# EAGLE schematic bjt_Vbe_on (EAGLE 7.5.0)
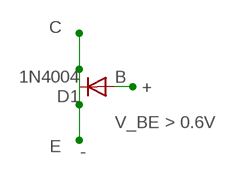
[diagram p0: schematic, sheet 1]

## Parts
D1  1N4004  [DO41-10]

## Nets
N$1: D1.C
N$2: D1.A

## Notes on the sheet
- C
- B | +
- V_BE > 0.6V
- E
- -

## Library data of the parts
D1 = diode:1N4004: DIODE general purpose rectifier, 1 A